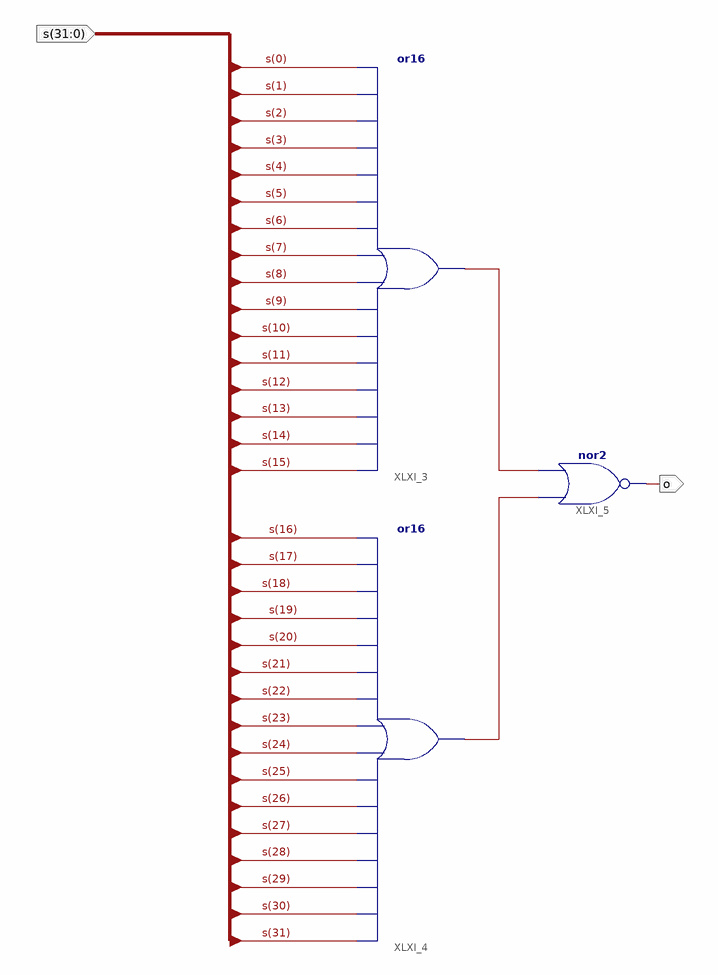
[diagram p0: schematic sheet 1]
// Xilinx ISE schematic NOR32.sch (spartan2) as structural Verilog: 3 symbols, 2 ports
module NOR32 (
  input  [31:0] s,
  output o
);

  wire XLXN_53, XLXN_54;

  or XLXI_3 (XLXN_53, s[15], s[14], s[13], s[12], s[11], s[10], s[9], s[8], s[7], s[6], s[5], s[4], s[3], s[2], s[1], s[0]);
  or XLXI_4 (XLXN_54, s[31], s[30], s[29], s[28], s[27], s[26], s[25], s[24], s[23], s[22], s[21], s[20], s[19], s[18], s[17], s[16]);
  nor XLXI_5 (o, XLXN_54, XLXN_53);
endmodule
